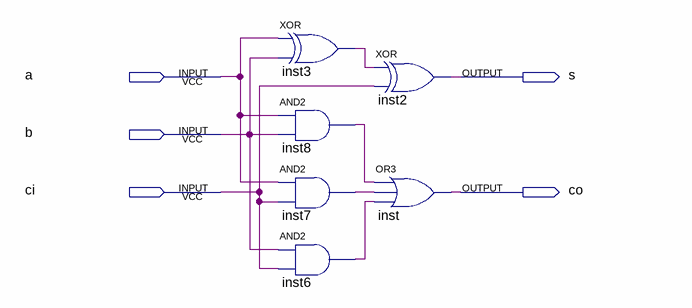
[diagram p0: schematic sheet]
// Quartus schematic SUM_1B.bdf as structural Verilog: 6 symbols, 5 pins
module SUM_1B (
  input  a,
  input  b,
  input  ci,
  output s,
  output co
);

  wire inst3_out, inst6_out, inst7_out, inst8_out;

  xor inst3 (inst3_out, a, b);
  and inst8 (inst8_out, a, b);
  and inst7 (inst7_out, a, ci);
  and inst6 (inst6_out, b, ci);
  xor inst2 (s, inst3_out, ci);
  or inst (co, inst8_out, inst7_out, inst6_out);
endmodule
